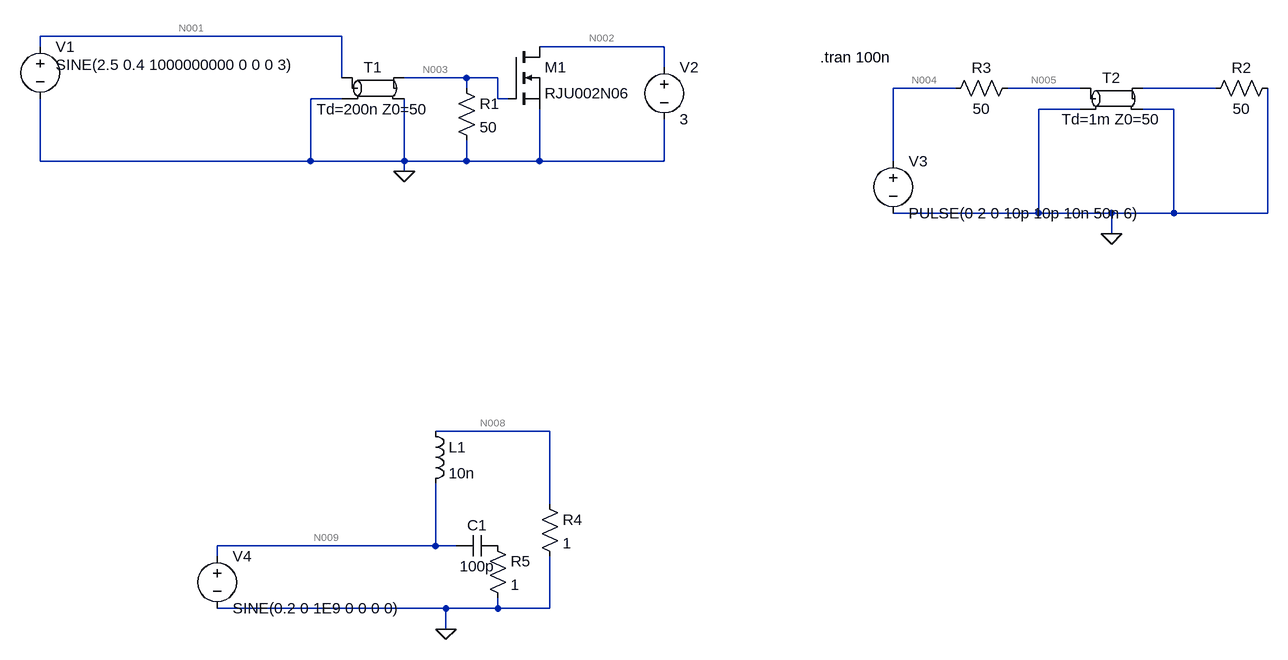
[diagram p0: schematic bias-tee.asc]
bias-tee.asc, the LTspice schematic file:
Version 4.1
SHEET 1 1176 900
WIRE -256 -32 -720 -32
WIRE -720 -16 -720 -32
WIRE 240 -16 48 -16
WIRE 240 16 240 -16
WIRE -256 32 -256 -32
WIRE -64 32 -160 32
WIRE -16 32 -64 32
WIRE -64 48 -64 32
WIRE 688 48 592 48
WIRE 880 48 768 48
WIRE 1088 48 976 48
WIRE -256 64 -304 64
WIRE -16 64 -16 32
WIRE 0 64 -16 64
WIRE 48 64 48 32
WIRE 880 80 816 80
WIRE 1024 80 976 80
WIRE -720 160 -720 64
WIRE -304 160 -304 64
WIRE -304 160 -720 160
WIRE -160 160 -160 64
WIRE -160 160 -304 160
WIRE -64 160 -64 128
WIRE -64 160 -160 160
WIRE 48 160 48 80
WIRE 48 160 -64 160
WIRE 240 160 240 96
WIRE 240 160 48 160
WIRE 592 160 592 48
WIRE -160 176 -160 160
WIRE 816 240 816 80
WIRE 816 240 592 240
WIRE 928 240 816 240
WIRE 1024 240 1024 80
WIRE 1024 240 928 240
WIRE 1168 240 1168 48
WIRE 1168 240 1024 240
WIRE 928 272 928 240
WIRE 64 576 -112 576
WIRE 64 688 64 576
WIRE -112 752 -112 656
WIRE -112 752 -448 752
WIRE -80 752 -112 752
WIRE -448 768 -448 752
WIRE -96 848 -448 848
WIRE -16 848 -16 832
WIRE -16 848 -96 848
WIRE 64 848 64 768
WIRE 64 848 -16 848
WIRE -96 880 -96 848
FLAG -160 176 0
FLAG 928 272 0
FLAG -96 880 0
SYMBOL nmos 0 -16 R0
SYMATTR InstName M1
SYMATTR Value RJU002N06
SYMBOL voltage -720 -32 R0
WINDOW 123 0 0 Left 0
WINDOW 39 0 0 Left 0
WINDOW 3 24 44 Left 2
SYMATTR Value SINE(2.5 0.4 1000000000 0 0 0 3)
SYMATTR InstName V1
SYMBOL voltage 240 0 R0
WINDOW 123 0 0 Left 0
WINDOW 39 0 0 Left 0
SYMATTR InstName V2
SYMATTR Value 3
SYMBOL tline -208 48 R0
SYMATTR InstName T1
SYMATTR Value Td=200n Z0=50
SYMBOL res -80 32 R0
SYMATTR InstName R1
SYMATTR Value 50
SYMBOL tline 928 64 R0
SYMATTR InstName T2
SYMATTR Value Td=1m Z0=50
SYMBOL voltage 592 144 R0
WINDOW 123 0 0 Left 0
WINDOW 39 0 0 Left 0
SYMATTR InstName V3
SYMATTR Value PULSE(0 2 0 10p 10p 10n 50n 6)
SYMBOL res 1184 32 R90
WINDOW 0 0 56 VBottom 2
WINDOW 3 32 56 VTop 2
SYMATTR InstName R2
SYMATTR Value 50
SYMBOL res 784 32 R90
WINDOW 0 0 56 VBottom 2
WINDOW 3 32 56 VTop 2
SYMATTR InstName R3
SYMATTR Value 50
SYMBOL ind -128 560 R0
SYMATTR InstName L1
SYMATTR Value 10n
SYMBOL voltage -448 752 R0
WINDOW 123 0 0 Left 0
WINDOW 39 0 0 Left 0
SYMATTR InstName V4
SYMATTR Value SINE(0.2 0 1E9 0 0 0 0)
SYMBOL cap -16 736 R90
WINDOW 0 0 32 VBottom 2
WINDOW 3 32 32 VTop 2
SYMATTR InstName C1
SYMATTR Value 100p
SYMBOL res 48 672 R0
SYMATTR InstName R4
SYMATTR Value 1
SYMBOL res -32 736 R0
SYMATTR InstName R5
SYMATTR Value 1
TEXT 480 0 Left 2 !.tran 100n

The netlist it stands for:
* bias-tee.asc
M1 N002 N003 0 0 RJU002N06
V1 N001 0 SINE(2.5 0.4 1000000000 0 0 0 3)
V2 N002 0 3
T1 N001 0 N003 0 Td=200n Z0=50
R1 N003 0 50
T2 N005 0 N006 0 Td=1m Z0=50
V3 N004 0 PULSE(0 2 0 10p 10p 10n 50n 6)
R2 0 N006 50
R3 N005 N004 50
L1 N008 N009 10n
V4 N009 0 SINE(0.2 0 1E9 0 0 0 0)
C1 P001 N009 100p
R4 N008 0 1
R5 P001 0 1
.model NMOS NMOS
.model PMOS PMOS
.lib standard.mos
.tran 100n
.backanno
.end

* Results of the author's LTspice run, read from the files saved beside the schematic
* Operating Point, zero values left out:
*   V(n003) = 2.5 V
*   V(n008) = 199.8 mV
*   V(n002) = 3 V
*   V(n001) = 2.5 V
*   V(n009) = 200 mV
*   Id(M1) = 557.9 mA
*   Is(M1) = -557.9 mA
*   I(R4) = 199.8 mA
*   I(V2) = -557.9 mA
*   I(R1) = 50 mA
*   I(V4) = -199.8 mA
*   I(V1) = -50 mA
*   Ia(T1) = 50 mA
*   Ic(T1) = -50 mA
*   Ib(T1) = -50 mA
*   Id(T1) = 50 mA
*   I(L1) = -199.8 mA
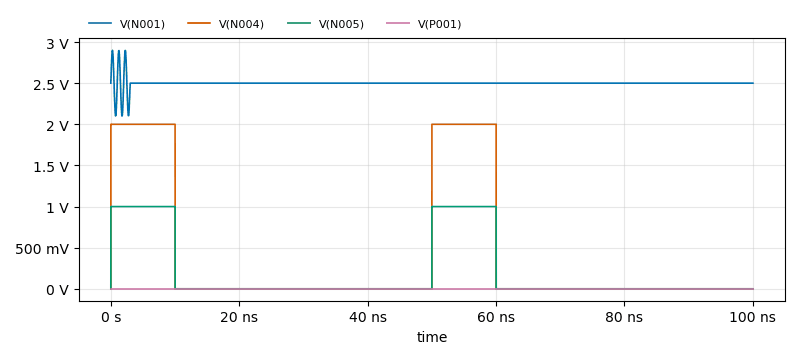
[diagram p1: Transient Analysis of bias-tee.asc, plotted from the saved traces]
* Transient Analysis, 1 run:
*   V(N001): min 2.1 V, max 2.898 V, average 2.5 V, rms 2.5 V, last 2.5 V
*   V(N004): min 0 V, max 2 V, average 400.4 mV, rms 894.9 mV, last 0 V
*   V(N005): min 0 V, max 1 V, average 200.2 mV, rms 447.4 mV, last 0 V
*   V(P001): min -0.2776 fV, max 0.02776 fV, average -0.09206 fV, rms 0.1004 fV, last -0.08327 fV